# Altium project EIP PCB0.1.PrjPCB
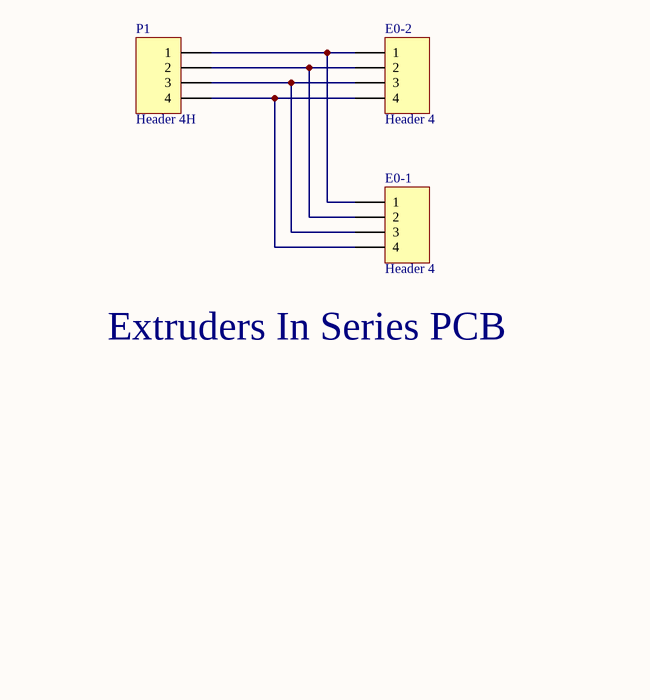
[diagram p0: EIP PCB0.1.SchDoc]
1 sheet, 3 parts. Net scope: global (net labels, ports and power ports of the same name join across sheets).
Board file: PCB1.PcbDoc

## Sheet EIP PCB0.1.SchDoc
size A

### Parts
E0-1  Header 4  [HDR1X4]
E0-2  Header 4  [HDR1X4]
P1  Header 4H  [HDR1X4H]

### Nets
NetE0-1_1: E0-1.1 E0-2.1 P1.1
NetE0-1_2: E0-1.2 E0-2.2 P1.2
NetE0-1_3: E0-1.3 E0-2.3 P1.3
NetE0-1_4: E0-1.4 E0-2.4 P1.4

### Notes on the sheet
- (near E0-1) Extruders In Series PCB

### Library data of the parts
E0-1 E0-2 = Header 4: CONN HEADER 4POS .100 VERT TIN; Manufacturer: Molex, LLC; Manufacturer Part Number: 0022272041; Digi-Key Part Number: WM4113-ND; Supplier: Digi-Key
P1 = Header 4H: CONN RECEPT 4POS .100 R/A PCB; Manufacturer Part Number: 0022152046; Digi-Key Part Number: WM3002-ND; Publisher: Molex Connector Corporation; Supplier: Digi-Key